# EAGLE design Commodore_KB_Tester (EAGLE 9.6.2)
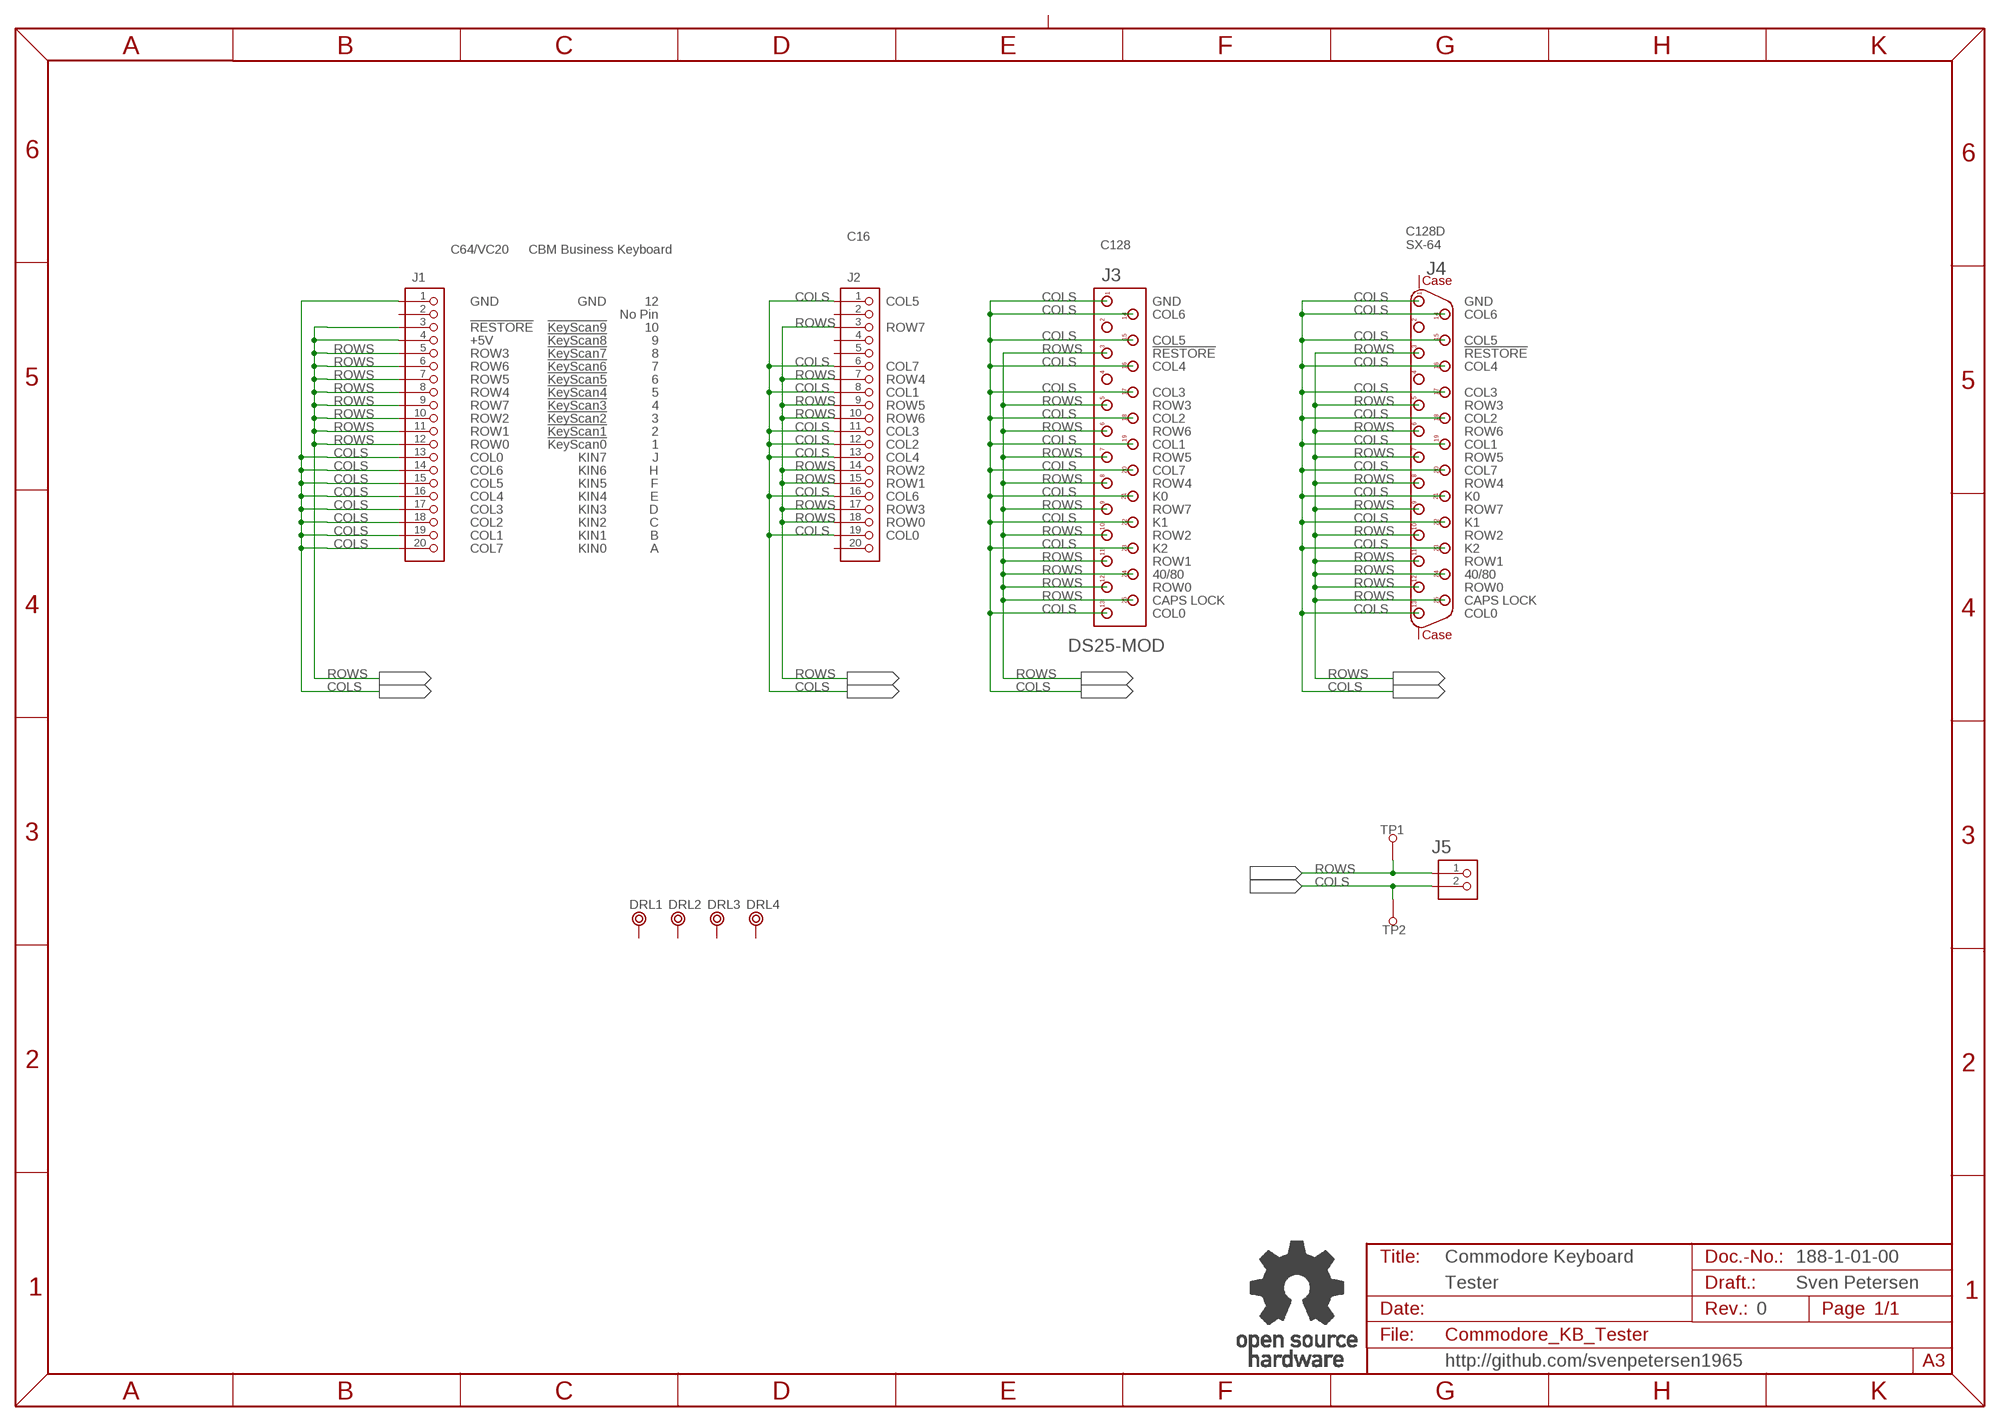
[diagram p0: schematic, sheet 1]

## Parts
DRL1  BOHR3,5  [BOHR3,5]
DRL2  BOHR3,5  [BOHR3,5]
DRL3  BOHR3,5  [BOHR3,5]
DRL4  BOHR3,5  [BOHR3,5]
J1  PINHD-1X20  [1X20]
J2  PINHD-1X20  [1X20]
J3  DS25-MOD  C128_KBHEADER  [C128KB_HEADER]
J4  DS25F-V-CL  [DS25F-V]
J5  PINHD-1X2  [1X02]
TP1  1,3/2,0  [1,3/2,0]
TP2  1,3/2,0  [1,3/2,0]
U$12  OPEN_SOURCE_HW  [OPENHW]

## Nets
COLS: J1.1 J1.13 J1.14 J1.15 J1.16 J1.17 J1.18 J1.19 J1.20 J2.1 J2.6 J2.8 J2.11 J2.12 J2.13 J2.16 J2.19 J3.1 J3.13 J3.14 J3.15 J3.16 J3.17 J3.18 J3.19 J3.20 J3.21 J3.22 J3.23 J4.1 J4.13 J4.14 J4.15 J4.16 J4.17 J4.18 J4.19 J4.20 J4.21 J4.22 J4.23 J5.2 TP2.1
ROWS: J1.3 J1.4 J1.5 J1.6 J1.7 J1.8 J1.9 J1.10 J1.11 J1.12 J2.3 J2.7 J2.9 J2.10 J2.14 J2.15 J2.17 J2.18 J3.3 J3.5 J3.6 J3.7 J3.8 J3.9 J3.10 J3.11 J3.12 J3.24 J3.25 J4.3 J4.5 J4.6 J4.7 J4.8 J4.9 J4.10 J4.11 J4.12 J4.24 J4.25 J5.1 TP1.1
Unconnected: DRL1.P$1 DRL2.P$1 DRL3.P$1 DRL4.P$1 J1.2 J2.2 J2.4 J2.5 J2.20 J3.2 J3.4 J4.2 J4.4 J4.PE1(CL1) J4.PE2(CL2)

## Notes on the sheet
- C16
- C64/VC20 | CBM Business Keyboard | C128
- C128D
  SX-64
- GND | GND | 12 | COL5 | GND | GND
- No Pin | COL6 | COL6
- !RESTORE | !KeyScan9 | 10 | ROW7
- +5V | !KeyScan8 | 9 | COL5 | COL5
- ROW3 | !KeyScan7 | 8 | !RESTORE | !RESTORE
- ROW6 | !KeyScan6 | 7 | COL7 | COL4 | COL4
- ROW5 | !KeyScan5 | 6 | ROW4
- ROW4 | !KeyScan4 | 5 | COL1 | COL3 | COL3
- ROW7 | !KeyScan3 | 4 | ROW5 | ROW3 | ROW3
- ROW2 | !KeyScan2 | 3 | ROW6 | COL2 | COL2
- ROW1 | !KeyScan1 | 2 | COL3 | ROW6 | ROW6
- ROW0 | !KeyScan0 | 1 | COL2 | COL1 | COL1
- COL0 | KIN7 | J | COL4 | ROW5 | ROW5
- COL6 | KIN6 | H | ROW2 | COL7 | COL7
- COL5 | KIN5 | F | ROW1 | ROW4 | ROW4
- COL4 | KIN4 | E | COL6 | K0 | K0
- COL3 | KIN3 | D | ROW3 | ROW7 | ROW7
- COL2 | KIN2 | C | ROW0 | K1 | K1
- COL1 | KIN1 | B | COL0 | ROW2 | ROW2
- COL7 | KIN0 | A | K2 | K2
- ROW1 | ROW1
- 40/80 | 40/80
- ROW0 | ROW0
- CAPS LOCK | CAPS LOCK
- COL0 | COL0
- Commodore Keyboard | 188-1-01-00
- Tester | Sven Petersen
- 0
- http://github.com/svenpetersen1965

## Library data of the parts
DRL1-DRL4 = Mech_Bohr:BOHR3,5
J1 J2 = PINHEAD:PINHD-1X20
J3 = Commodore:C128_KBHEADER
J4 = Connec:DS25F-V-CL
J5 = PINHEAD:PINHD-1X2
TP1 TP2 = Pads:1,3/2,0: Testpunkt Typ: 13.70.635 Hersteller: Ettinger Technologie: Einpresstechnik Bauform: - erzeugt von: C. Zellner am: 13.3.2015 letzte Änderung: - Eagle-Version: 6.5.0
U$12 = Logo:OPEN_SOURCE_HW

## Board
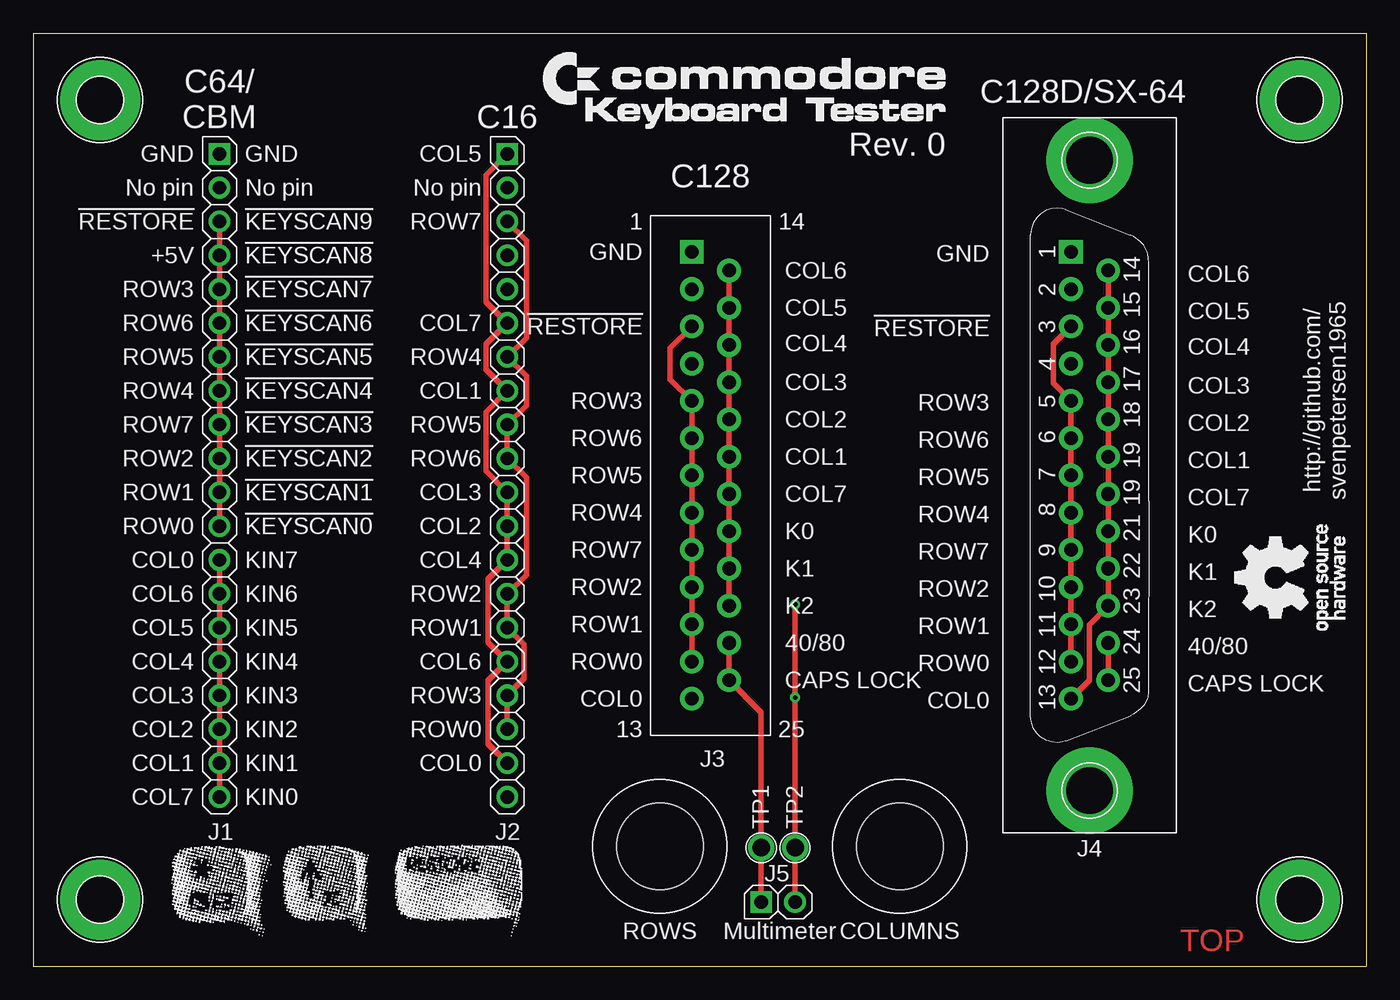
[diagram p1: board, top side]
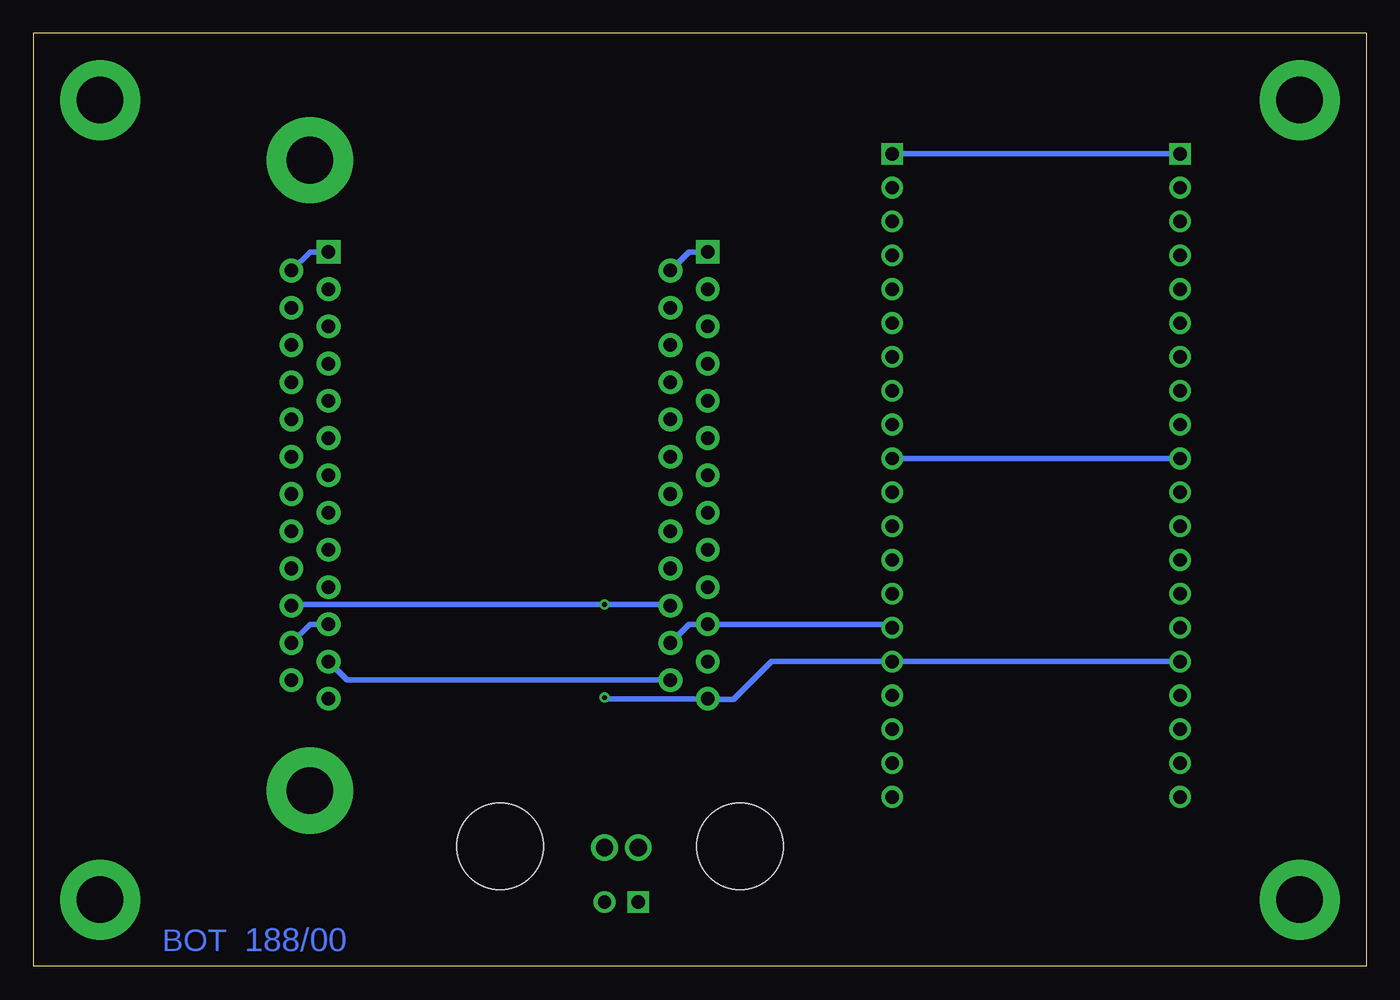
[diagram p2: board, bottom side, seen from below]

Size 100 x 70 mm. Coordinates in mm from the lower left corner, seen from the top.
Outline: 0,0 100,0 100,70 0,70 0,0
Copper layers (1*16): Top 0.035mm / dielectric 1.5mm / Bottom 0.035mm
Design rules "default *": minimum track width 6mil, minimum drill 0.35mm, track to track 6mil, track to pad 6mil, pad to pad 6mil, via to via 6mil, smd to smd 6mil, copper to edge 40mil, drill to drill 6mil, minimum pad ring 10mil, minimum via ring 8mil, stop-mask expansion 4mil, vias tented up to drill 23mil, thermal gap 10mil
Holes 6.5 mm at 65,9 47,9

### Footprints (pad centres in the part's own frame; a part is rotated, then mirrored left to right if it is on the bottom)
BOHR3,5 = drill 3.5 pad 6: P$1 0,0
1X20 = drill 1 pad 1.626 square: 1 -24.13,0 | drill 1 pad 1.626: 2 -21.59,0; 3 -19.05,0; 4 -16.51,0; 5 -13.97,0; 6 -11.43,0; 7 -8.89,0; 8 -6.35,0; 9 -3.81,0; 10 -1.27,0; 11 1.27,0; 12 3.81,0; 13 6.35,0; 14 8.89,0; 15 11.43,0; 16 13.97,0; 17 16.51,0; 18 19.05,0; 19 21.59,0; 20 24.13,0
C128KB_HEADER = drill 1.016 pad 1.778 square: 1 -1.397,16.764 | drill 1.016 pad 1.778: 2 -1.397,13.97; 3 -1.397,11.176; 4 -1.397,8.382; 5 -1.397,5.588; 6 -1.397,2.794; 7 -1.397,0; 8 -1.397,-2.794; 9 -1.397,-5.588; 10 -1.397,-8.382; 11 -1.397,-11.176; 12 -1.397,-13.97; 13 -1.397,-16.764; 14 1.397,15.367; 15 1.397,12.573; 16 1.397,9.779; 17 1.397,6.985; 18 1.397,4.191; 19 1.397,1.397; 20 1.397,-1.397; 21 1.397,-4.191; 22 1.397,-6.985; 23 1.397,-9.779; 24 1.397,-12.573; 25 1.397,-15.367
DS25F-V = drill 1.016 pad 1.778 square: 1 16.764,1.397 | drill 1.016 pad 1.778: 2 13.97,1.397; 3 11.176,1.397; 4 8.382,1.397; 5 5.588,1.397; 6 2.794,1.397; 7 0,1.397; 8 -2.794,1.397; 9 -5.588,1.397; 10 -8.382,1.397; 11 -11.176,1.397; 12 -13.97,1.397; 13 -16.764,1.397; 14 15.367,-1.397; 15 12.573,-1.397; 16 9.779,-1.397; 17 6.985,-1.397; 18 4.191,-1.397; 19 1.397,-1.397; 20 -1.397,-1.397; 21 -4.191,-1.397; 22 -6.985,-1.397; 23 -9.779,-1.397; 24 -12.573,-1.397; 25 -15.367,-1.397 | drill 3.505 pad 6.477: PE1 -23.654,0; PE2 23.654,0
1X02 = drill 1 pad 1.626 square: 1 -1.27,0 | drill 1 pad 1.626: 2 1.27,0
1,3/2,0 = drill 1.3 pad 2: 1 0,0

### Placement (x,y rotation side)
DRL1  5,5 0 top
DRL2  95,5 0 top
DRL3  95,65 0 top
DRL4  5,65 0 top
J1  13.97,36.83 270 top
J2  35.56,36.83 270 top
J3  50.8,36.83 0 top
J4  79.25,36.83 90 top
J5  55.88,4.81 0 top
TP1  54.61,8.89 0 top
TP2  57.15,8.89 0 top
U$12  98.41,25.22 90 top
U$13  [C64_KEYS]  10.33,1.65 0 top
U$14  [2LAYER]  86.04,1.11 0 top
U$15  [PCB-TITLE/]  0.16,81.28 0 top  (outside the outline)
U$16  [COMMODORE_KB]  38.26,62.87 0 top

### Tracks (layer width: path | path; a pad name or v marks a point on that pad's centre or on a via)
COLS  (via drill 0.35)
  Top 0.406: J1.13 J1.14 J1.15 J1.16 J1.17 J1.18 J1.19 J1.20 | J2.19 34.13,16.67 34.13,21.43 J2.16 34.13,24.29 34.13,29.05 J2.13 J2.12 J2.11 33.97,37.15 33.97,41.59 J2.8 33.97,44.77 33.97,46.67 J2.6 33.97,49.85 33.97,59.37 J2.1 | J3.14 J3.15 J3.16 J3.17 J3.18 J3.19 J3.20 J3.21 J3.22 J3.23 | v57.15,27.15 v57.15,20.16 TP2.1 J5.2 | J4.13 79.22,21.43 79.22,25.62 J4.23 J4.22 J4.21 J4.20 J4.19 J4.18 J4.17 J4.16 J4.15 J4.14
  Bottom 0.406: J1.1 J2.1 | J1.16 J2.16 44.61,22.86 47.47,20 49.34,20 J3.13 57.05,20.07 v57.15,20.16 | J3.1 50.8,53.59 J3.14 | J3.23 52.29,27.15 v57.15,27.15 76.2,27.15 80.55,27.15 J4.23 | J4.1 79.25,53.59 J4.14
ROWS
  Top 0.406: J1.3 J1.4 J1.5 J1.6 J1.7 J1.8 J1.9 J1.10 J1.11 J1.12 | J2.18 J2.17 36.83,21.59 36.83,24.13 J2.15 J2.14 36.99,29.37 36.99,36.67 J2.10 J2.9 36.99,42.07 36.99,44.29 J2.7 36.99,47.15 36.99,54.45 J2.3 | J3.12 J3.11 J3.10 J3.9 J3.8 J3.7 J3.6 J3.5 47.78,44.04 47.78,46.39 J3.3 | J3.24 J3.25 54.61,19.05 TP1.1 J5.1 | J4.12 J4.11 J4.10 J4.9 J4.8 J4.7 J4.6 J4.5 76.52,43.75 76.52,46.67 J4.3 | J4.25 J4.24
  Bottom 0.406: J1.10 J2.10 | J2.15 35.81,25.65 J3.11 50.8,25.65 J3.24 | J4.11 79.25,25.65 J4.24 | J3.25 76.45,21.46 J4.12

### Text on the board
Bottom: 188/00
tPlace: Rev. 0
tNames: C128D/SX-64 | C64/ / CBM | C16 | GND | GND | COL5 | No pin | No pin | No pin | C128 | !RESTORE | !KEYSCAN9 | ROW7 | GND | +5V | !KEYSCAN8 | GND | COL6 | COL6 | ROW3 | !KEYSCAN7 | COL5 | COL5 | ROW6 | !KEYSCAN6 | COL7 | !RESTORE | !RESTORE | COL4 | ROW5 | !KEYSCAN5 | ROW4 | COL4 | COL3 | COL3 | ROW4 | !KEYSCAN4 | COL1 | ROW3 | ROW3 | http://github.com/ / svenpetersen1965 | ROW7 | !KEYSCAN3 | ROW5 | COL2 | COL2 | ROW6 | ROW6 | ROW2 | !KEYSCAN2 | ROW6 | COL1 | COL1 | ROW5 | ROW5 | ROW1 | !KEYSCAN1 | COL3 | COL7 | COL7 | ROW4 | ROW4 | ROW0 | !KEYSCAN0 | COL2 | K0 | K0 | ROW7 | ROW7 | COL0 | KIN7 | COL4 | K1 | K1 | COL6 | KIN6 | ROW2 | ROW2 | ROW2 | K2 | K2 | ROW1 | ROW1 | COL5 | KIN5 | ROW1 | 40/80 | 40/80 | COL4 | KIN4 | COL6 | ROW0 | ROW0 | CAPS LOCK | CAPS LOCK | COL3 | KIN3 | ROW3 | COL0 | COL0 | COL2 | KIN2 | ROW0 | COL1 | KIN1 | COL0 | COL7 | KIN0 | ROWS | Multimeter | COLUMNS
Document: Sven Petersen | 188-2-01-00 | 2022 | 35µm | 2 | 0